# EAGLE design Preisrahmen Tibber (EAGLE 7.5.0)
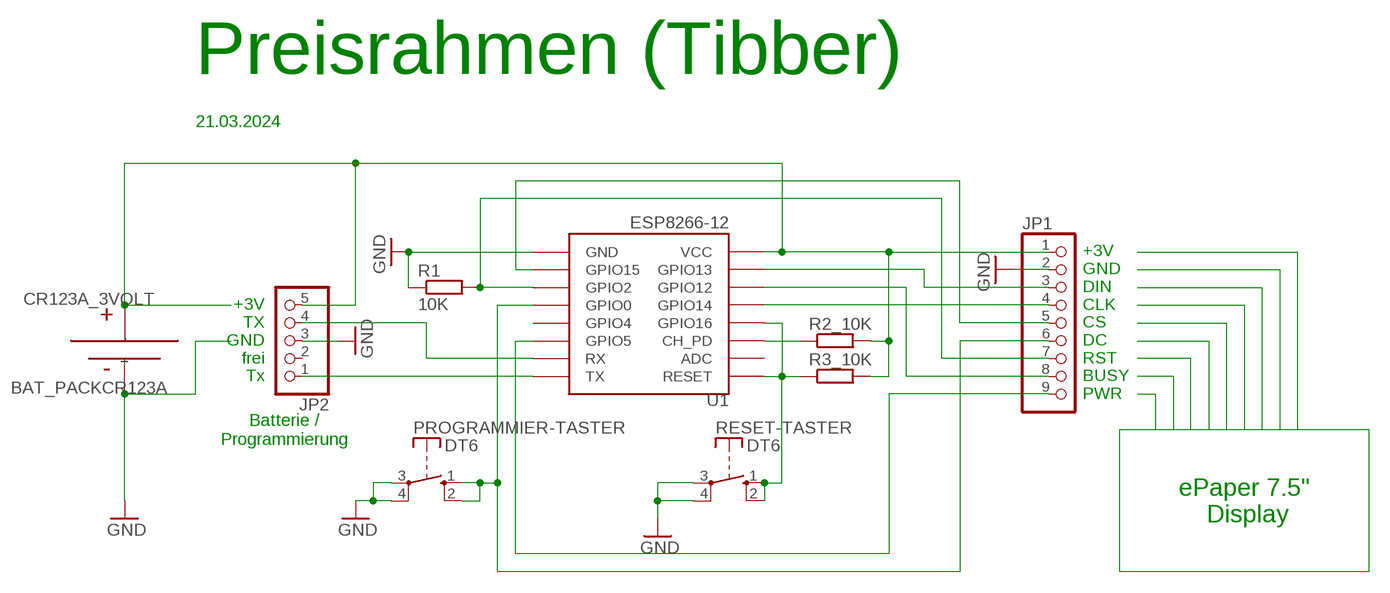
[diagram p0: schematic, sheet 1]

## Parts
CR123A_3VOLT  BAT_PACKCR123A  [BH123A]
JP1  PINHD-1X9/90  [1X09/90]
JP2  PINHD-1X5/90  [1X05/90]
PROGRAMMIER-TASTER  DT6  [DT6]
R1  10K  R-EU_0207/7  [0207/7]
R2_10K  R-EU_0207/7  [0207/7]
R3_10K  R-EU_0207/7  [0207/7]
RESET-TASTER  DT6  [DT6]
U1  ESP8266-12  ESP12  [ESP12]

## Nets
GND: CR123A_3VOLT.- JP1.2 JP2.3 PROGRAMMIER-TASTER.3(P) PROGRAMMIER-TASTER.4(P) R1.1 RESET-TASTER.3(P) RESET-TASTER.4(P) U1.GND
N$1: R2_10K.1 U1.CH_PD
N$4: R3_10K.1 RESET-TASTER.1(S) RESET-TASTER.2(S) U1.GPIO16 U1.RESET
N$5: JP1.7 R1.2 U1.GPIO2
N$6: JP1.6 PROGRAMMIER-TASTER.1(S) PROGRAMMIER-TASTER.2(S) U1.GPIO0
N$7: JP2.1 U1.TX
N$8: JP2.4 U1.RX
N$9: JP1.9 U1.GPIO5
N$10: JP1.3 U1.GPIO13
N$11: JP1.4 U1.GPIO14
N$12: JP1.5 U1.GPIO15
N$13: CR123A_3VOLT.+ JP1.1 JP2.5 R2_10K.2 R3_10K.2 U1.VCC
N$16: JP1.8 U1.GPIO12
Unconnected: JP2.2 U1.ADC U1.GPIO4

## Notes on the sheet
- Preisrahmen (Tibber)
- 21.03.2024
- +3V
  TX
  GND
  frei
  Tx
- +3V
  GND
  DIN
  CLK
  CS
  DC
  RST
  BUSY
  PWR
- Batterie /
  Programmierung
- ePaper 7.5"
   Display

## Library data of the parts
CR123A_3VOLT = batteries:BAT_PACK: collection of battery footprints; DIGIKEY: BH123A-ND; MANUFACTURER: MPD; MPN: BH123A
JP1 = pinhead:PINHD-1X9: PIN HEADER
JP2 = pinhead:PINHD-1X5: PIN HEADER
PROGRAMMIER-TASTER RESET-TASTER = switch-misc:DT: ITT SWITCH
R1 R2_10K R3_10K = rcl:R-EU_: RESISTOR, European symbol
U1 = esp8266modules:ESP12: ESP8266 Wifi module 12

## Board
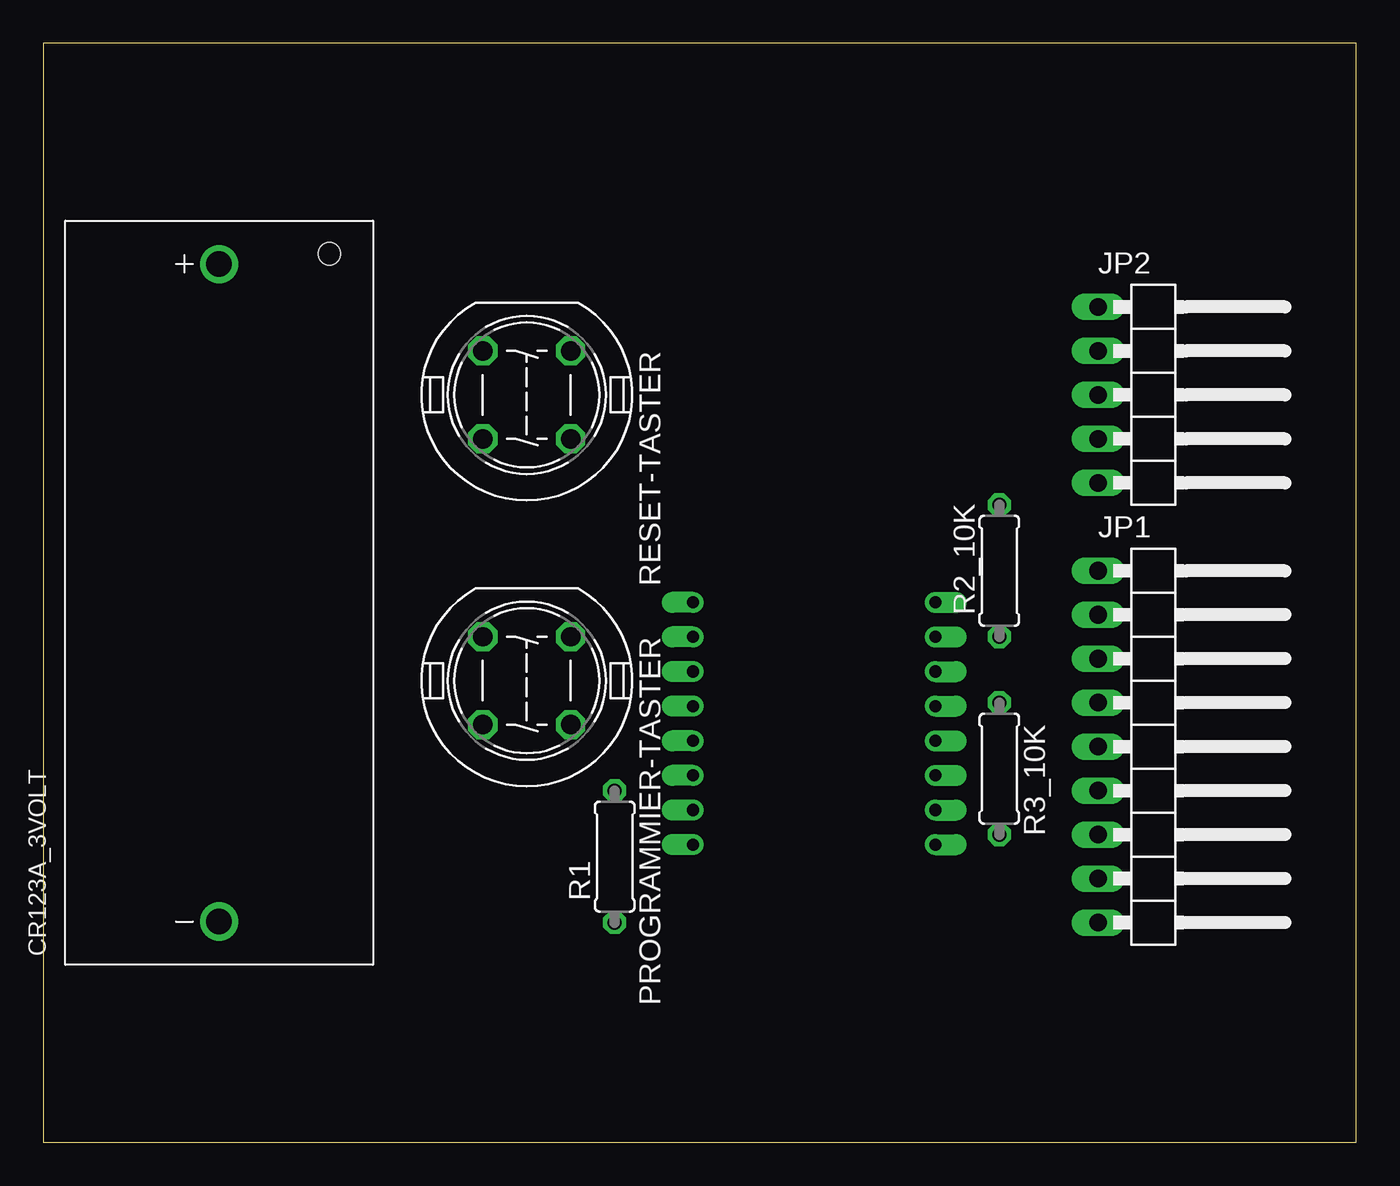
[diagram p1: board, top side]
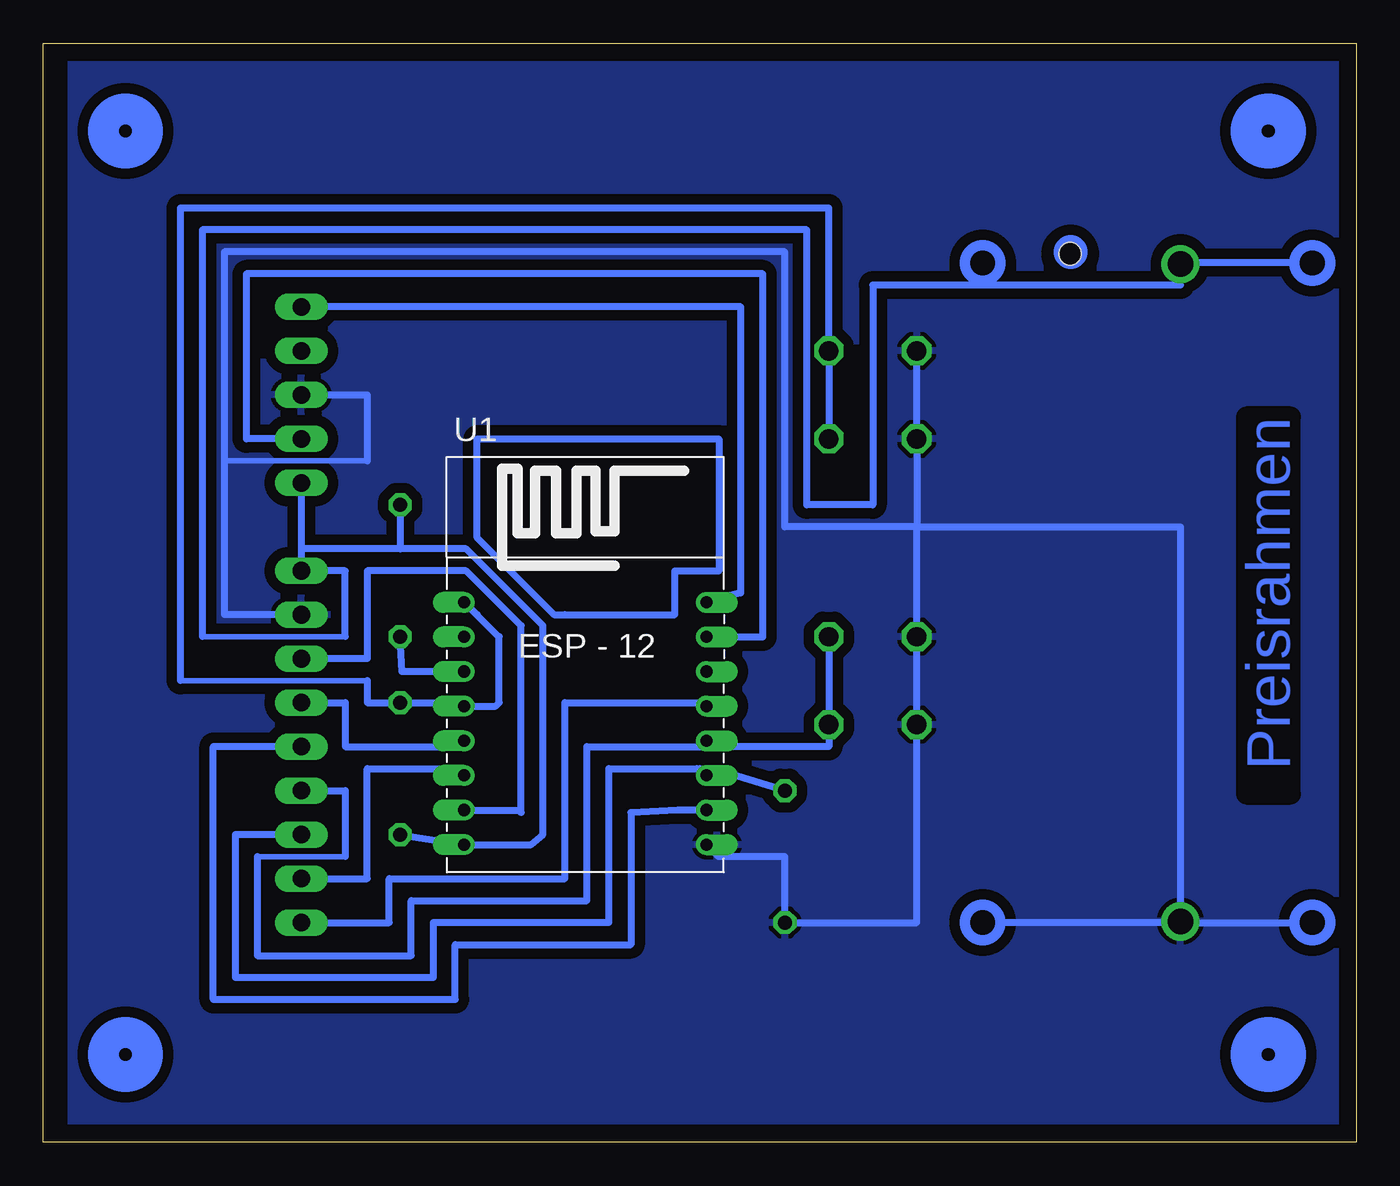
[diagram p2: board, bottom side, seen from below]

Size 75.87 x 63.49 mm. Coordinates in mm from the lower left corner, seen from the top.
Outline: 0,0 75.87,0 75.87,63.49 0,63.49 0,0
Copper layers (1*16): Top 0.035mm / dielectric 1.5mm / Bottom 0.035mm
Design rules "default": minimum track width 10mil, minimum drill 24mil, track to track 8mil, track to pad 8mil, pad to pad 8mil, via to via 8mil, smd to smd 8mil, copper to edge 40mil, drill to drill 8mil, minimum pad ring 10mil, minimum via ring 8mil, stop-mask expansion 4mil, vias tented up to drill 0mil, thermal gap 10mil

### Footprints (pad centres in the part's own frame; a part is rotated, then mirrored left to right if it is on the bottom)
BH123A = drill 1.47: + 18.985,0; - -18.985,0 | hole 1.27: 19.58,-6.37
1X09/90 = drill 1.016 long: 1 -10.16,-3.81; 2 -7.62,-3.81; 3 -5.08,-3.81; 4 -2.54,-3.81; 5 0,-3.81; 6 2.54,-3.81; 7 5.08,-3.81; 8 7.62,-3.81; 9 10.16,-3.81
1X05/90 = drill 1.016 long: 1 -5.08,-3.81; 2 -2.54,-3.81; 3 0,-3.81; 4 2.54,-3.81; 5 5.08,-3.81
DT6 = drill 1.118 octagon: 1 -2.54,2.54; 2 2.54,2.54; 3 2.54,-2.54; 4 -2.54,-2.54
0207/7 = drill 0.813 octagon: 1 -3.81,0; 2 3.81,0
ESP12 = drill 0.7 offset: ADC -7.1,3.8; CH_PD -7.1,1.8; GND 6.9,-8.2; GPIO0 6.9,-2.2; GPIO2 6.9,-4.2; GPIO4 6.9,1.8; GPIO5 6.9,-0.2; GPIO12 -7.1,-4.2; GPIO13 -7.1,-6.2; GPIO14 -7.1,-2.2; GPIO15 6.9,-6.2; GPIO16 -7.1,-0.2; RESET -7.1,5.8; RX 6.9,3.8; TX 6.9,5.8; VCC -7.1,-8.2

### Placement (x,y rotation side)
CR123A_3VOLT  10.16,31.75 90 top
JP1  64.77,22.86 270 top
JP2  64.77,43.18 270 top
PROGRAMMIER-TASTER  27.94,26.67 270 top
R1  33.02,16.51 90 top
R2_10K  55.24,33.02 90 top
R3_10K  55.24,21.59 270 top
RESET-TASTER  27.94,43.18 270 top
U1  44.45,25.4 0 bottom

### Tracks (layer width: path | path; a pad name or v marks a point on that pad's centre or on a via)
GND
  Bottom 0.305: 57.15,39.37 65.41,39.37
  Bottom 0.406: JP2.3 57.15,43.18 57.15,39.37 | 25.4,35.56 PROGRAMMIER-TASTER.4 PROGRAMMIER-TASTER.3 25.4,12.7 R1.1 33.02,16.51 36.86,16.51 U1.GND | 25.4,35.56 RESET-TASTER.3 RESET-TASTER.4 | 25.4,35.56 33.02,35.56 33.02,51.44 65.41,51.44 65.41,39.37 65.41,30.48 JP1.2 | 25.4,35.56 10.16,35.56 10.16,12.7 | 10.16,12.7 3.81,12.7 | 10.16,12.7 20.32,12.7
  pour Bottom (isolate 0.61): 0,63.5 74.3,63.5 74.3,0 0,0
N$1
  Bottom 0.406: U1.CH_PD 55.14,27.2 R2_10K.1
N$2
  Bottom 0.406: 3.81,50.8 10.16,50.8
N$3
  Bottom 0.406: 45.72,30.48 39.37,30.48 39.37,33.02 36.83,33.02 36.83,40.64 50.8,40.64 50.8,34.92 46.35,30.48 45.72,30.48
N$4
  Bottom 0.305: 67.94,26.67 57.15,26.67
  Bottom 0.406: 50.8,30.48 51.55,31.23 U1.RESET 49.56,29.21 49.53,29.21 49.53,25.4 49.73,25.2 U1.GPIO16 52.07,25.4 R3_10K.1 57.15,25.4 57.15,26.67 | 67.94,26.67 67.94,53.98 30.48,53.98 RESET-TASTER.1 RESET-TASTER.2
N$5
  Bottom 0.406: 38.1,21.59 43.18,21.59 43.18,12.7 53.34,12.7 53.34,9.53 64.77,9.53 64.77,17.78 JP1.7 | 38.1,21.59 37.94,21.59 U1.GPIO2 | U1.GPIO2 37.71,21.2 38.1,21.59 | R1.2 37.16,21.59 U1.GPIO2
N$6
  Bottom 0.305: 58.42,16.51 63.5,16.51
  Bottom 0.406: JP1.6 58.42,20.32 58.42,16.51 | 63.5,16.51 63.5,10.79 54.61,10.79 54.61,13.97 44.45,13.97 44.45,22.86 37.89,22.86 U1.GPIO0 37.21,22.86 30.48,22.86 PROGRAMMIER-TASTER.2 PROGRAMMIER-TASTER.1
N$7
  Bottom 0.406: JP2.1 35.56,48.26 35.56,31.75 U1.TX
N$8
  Bottom 0.406: U1.RX 34.3,29.2 34.29,29.21 34.29,50.16 64.14,50.16 64.14,40.64 JP2.4
N$9
  Bottom 0.406: 37.35,25.4 45.72,25.4 45.72,15.24 55.88,15.24 55.88,12.7 JP1.9 | 36.83,25.4 37.35,25.4 | 37.35,25.4 U1.GPIO5
N$10
  Bottom 0.406: U1.GPIO13 48.41,19.2 48.26,19.05 48.26,29.84 51.44,33.02 57.15,33.02 57.15,27.94 JP1.3
N$11
  Bottom 0.406: JP1.4 58.42,25.4 58.42,22.86 51.89,22.86 U1.GPIO14
N$12
  Bottom 0.406: U1.GPIO15 39.22,19.2 41.91,19.05 41.91,11.43 52.07,11.43 52.07,8.26 66.04,8.26 66.04,22.86 JP1.5
N$13
  Bottom 0.305: 66.67,29.21 58.42,29.21
  Bottom 0.406: 55.24,34.29 60.96,34.29 | JP2.5 60.96,34.29 | 60.96,34.29 JP1.1 58.42,33.02 58.42,29.21 | R2_10K.2 55.24,34.29 | 66.67,29.21 66.67,52.7 31.75,52.7 31.75,36.83 27.94,36.83 27.94,49.53 10.16,49.53 CR123A_3VOLT.+ | 55.24,34.29 51.44,34.29 46.99,29.84 46.99,17.78 47.68,17.2 U1.VCC R3_10K.2
N$16
  Bottom 0.406: JP1.8 57.15,15.24 57.15,21.59 51.94,21.59 U1.GPIO12
(copper drawn outside any net)
  shapes: Bottom circle x9

### Text on the board
Bottom: Preisrahmen